# EAGLE design onetesla (EAGLE 6.1)
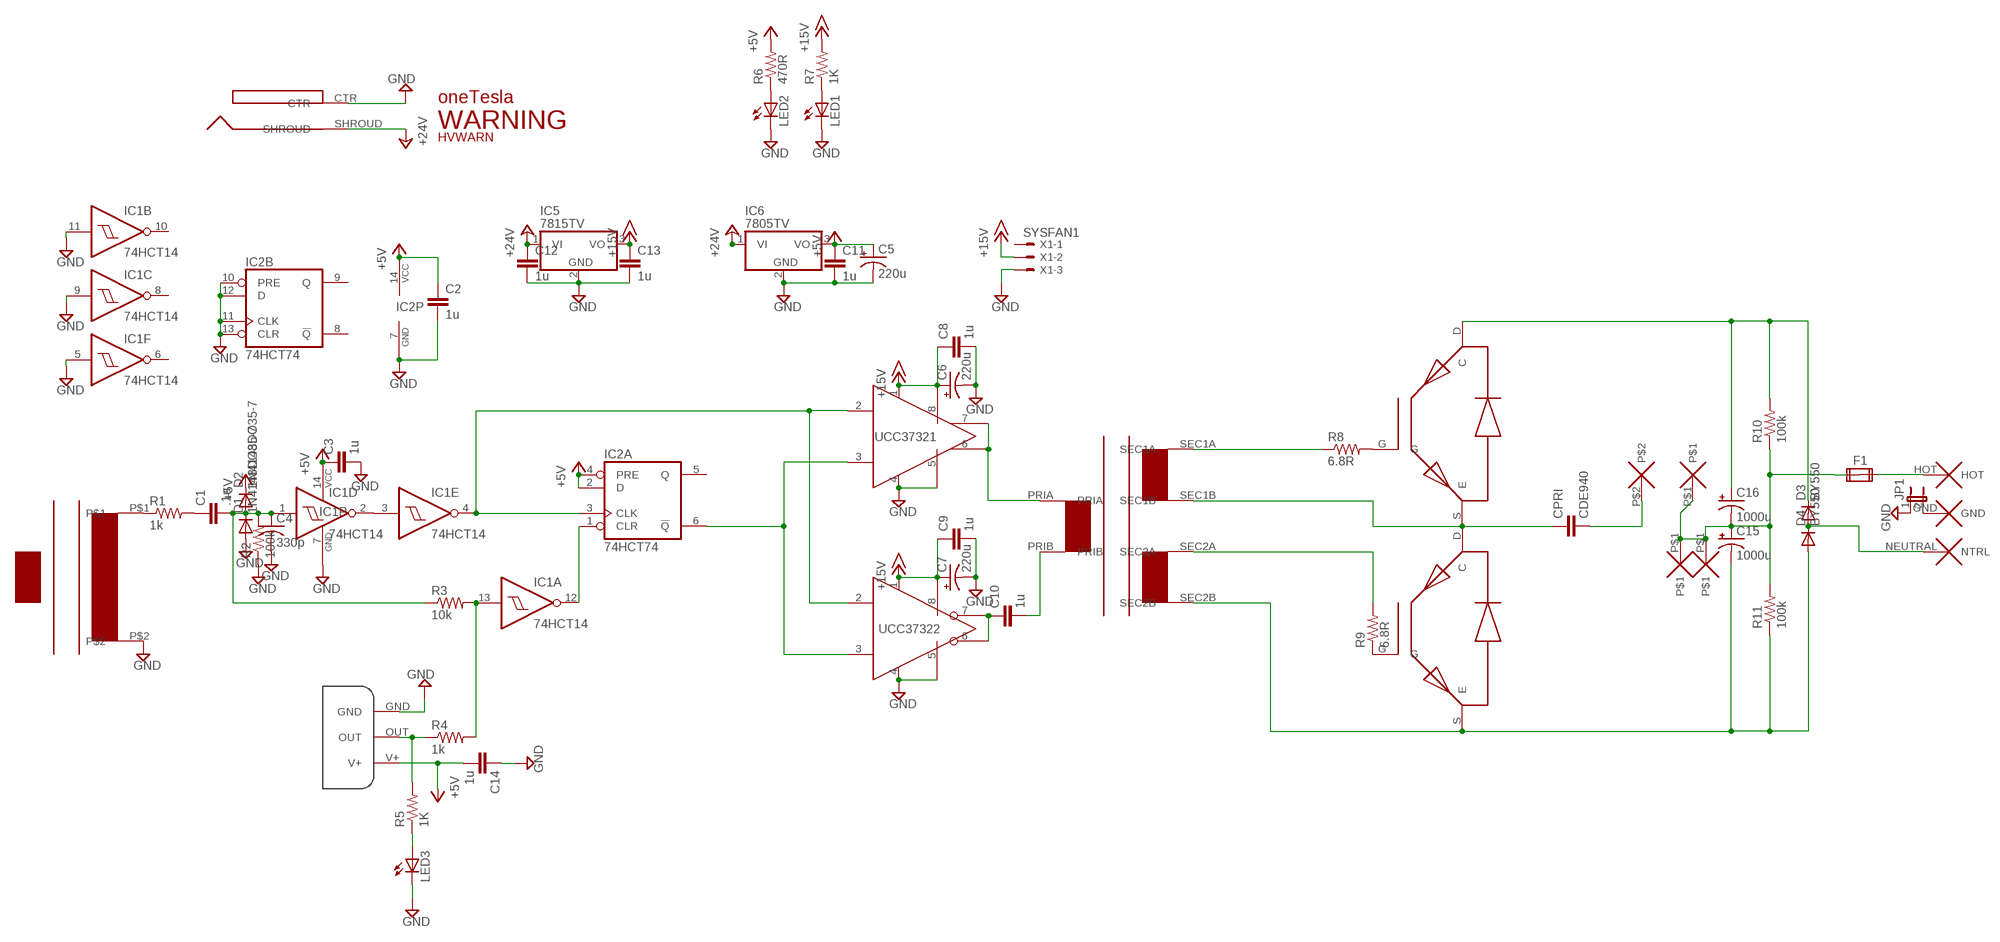
[diagram p0: schematic, sheet 1]

## Parts
C1  .1u  C-EU050-024X044  [C050-024X044]
C2  1u  C-EU050-024X044  [C050-024X044]
C3  1u  C-EU050-024X044  [C050-024X044]
C4  330p  C-US025-024X044  [C025-024X044]
C5  220u  CPOL-USE5-10.5  [E5-10,5]
C6  220u  CPOL-USE5-10.5  [E5-10,5]
C7  220u  CPOL-USE5-10.5  [E5-10,5]
C8  1u  C-EU050-024X044  [C050-024X044]
C9  1u  C-EU050-024X044  [C050-024X044]
C10  1u  C-EU050-024X044  [C050-024X044]
C11  1u  C-EU050-024X044  [C050-024X044]
C12  1u  C-EU050-024X044  [C050-024X044]
C13  1u  C-EU050-024X044  [C050-024X044]
C14  1u  C-EU050-024X044  [C050-024X044]
C15  1000u  CPOL-USE10-25  [EB25D]
C16  1000u  CPOL-USE10-25  [EB25D]
CPRI  CDE940  [CDE940]
CT1  TRIAD_CT  [CT2]
D1  1N4148DO35-7  [DO35-7]
D2  1N4148DO35-7  [DO35-7]
D3  BY550  [DO27-15]
D4  BY550  [DO27-15]
F1  FUSE2P  [FUSE1]
FB1  IFD95_OPTO  [IFD95]
IC1  74HCT14  74LS14N  [DIL14]
IC2  74HCT74  74LS74N  [DIL14]
IC3  UCC37321DIL8  [DIL08]
IC4  UCC37322DIL8  [DIL08]
IC5  7815TV  [TO220V]
IC6  7805TV  [TO220V]
J1  DC-IN  PJ-037B  [DJC0202]
J2  IEC  [IECPORT]
JP1  JP1E  [JP1]
LED1  LED5MM  [LED5MM]
LED2  LED5MM  [LED5MM]
LED3  LED5MM  [LED5MM]
LPRI  2TERMINAL  [2TERMINAL]
Q1  FGA60N65SMD  FGH40N60SMD  [TO247BV]
Q2  FGA60N65SMD  FGH40N60SMD  [TO247BV]
R1  1k  RES_5W  [0922/22]
R2  100k  R-US_0204/7  [0204/7]
R3  10k  R-US_0204/7  [0204/7]
R4  1k  R-US_0204/7  [0204/7]
R5  1K  R-US_0207/7  [0207/7]
R6  470R  R-US_0207/7  [0207/7]
R7  1K  R-US_0207/7  [0207/7]
R8  6.8R  R-US_0309/V  [0309V]
R9  6.8R  R-US_0309/V  [0309V]
R10  100k  R-US_0309/10  [0309/10]
R11  100k  R-US_0309/10  [0309/10]
U$1  LOGO  [LOGO]
U$2  GDT  [GDT]
U$3  WARNING  [WARNING]
U$4  HVWARNING  [HVWARNING]
U$9  12AWG_PAD  [12AWG_PAD]
U$11  12AWG_PAD  [12AWG_PAD]
X1  SYSFAN1  22-23-2031  [22-23-2031]

## Nets
+5V: C2.1 C3.1 C5.+ C11.1 C14.2 D2.C FB1.V+ IC1.14(P:VCC) IC2.2(A:D) IC2.4(A:PRE) IC2.14(P:VCC) IC6.3(VO) R6.2
+15V: C6.+ C7.+ C8.1 C9.1 C13.1 IC3.1(1_VDD) IC3.8(8_VDD) IC4.1(1_VDD) IC4.8(8_VDD) IC5.3(VO) R7.2 X1.2
+24V: C12.1 IC5.1(VI) IC6.1(VI) J1.SHROUD
GND: C2.2 C3.2 C4.2 C5.- C6.- C7.- C8.2 C9.2 C11.2 C12.2 C13.2 C14.1 CT1.P$2 D1.A FB1.GND IC1.5(F:I) IC1.7(P:GND) IC1.9(C:I) IC1.11(B:I) IC2.7(P:GND) IC2.10(B:PRE) IC2.11(B:CLK) IC2.12(B:D) IC2.13(B:CLR) IC3.4(4_AGND) IC3.5(5_PGND) IC4.4(4_AGND) IC4.5(5_PGND) IC5.2(GND) IC6.2(GND) J1.CTR JP1.1 LED1.K(C) LED2.K(C) LED3.K(C) R2.1 X1.3
N$1: CT1.P$1 R1.1
N$2: C1.1 R1.2
N$3: C1.2 C4.1 D1.C D2.A IC1.1(D:I) R2.2 R3.1
N$4: IC1.2(D:O) IC1.3(E:I)
N$5: IC2.6(A:!Q) IC3.3(3_ENBL) IC4.3(3_ENBL)
N$6: IC1.4(E:O) IC2.3(A:CLK) IC3.2(2_IN) IC4.2(2_IN)
N$7: LED2.A R6.1
N$8: C10.2 U$2.PRIB
N$9: CPRI.P$1 Q1.S(E) Q2.D(C) U$2.SEC1B
N$10: C10.1 IC4.6(6_OUT) IC4.7(7_OUT)
N$11: IC3.6(6_OUT) IC3.7(7_OUT) U$2.PRIA
N$12: Q1.G R8.2
N$13: LED1.A R7.1
N$14: Q2.G R9.1
N$15: FB1.OUT R4.1 R5.2
N$16: IC1.13(A:I) R3.2 R4.2
N$17: D3.A D4.C J2.NEUTRAL(NTRL)
N$18: R8.1 U$2.SEC1A
N$19: R9.2 U$2.SEC2A
N$20: IC1.12(A:O) IC2.1(A:CLR)
N$21: J2.GND JP1.2
N$22: CPRI.P$2 LPRI.P$2
N$23: F1.2A J2.HOT
N$24: LED3.A R5.1
N$25: C15.+ C16.- F1.1A F1.1B LPRI.P$1 R10.1 R11.2 U$9.P$1 U$11.P$1
V+: C16.+ D3.C Q1.D(C) R10.2
V-: C15.- D4.A Q2.S(E) R11.1 U$2.SEC2B
Unconnected: F1.2B IC1.6(F:O) IC1.8(C:O) IC1.10(B:O) IC2.5(A:Q) IC2.8(B:!Q) IC2.9(B:Q) X1.1

## Library data of the parts
C1-C3 C8-C14 = rcl:C-EU: CAPACITOR, European symbol
C4 = rcl:C-US: CAPACITOR, American symbol
C5-C7 C15 C16 = rcl:CPOL-US: POLARIZED CAPACITOR, American symbol
CPRI = smallcoil:CDE940
CT1 = smallcoil:TRIAD_CT
D1 D2 = diode:1N4148: DIODE high speed (Philips)
D3 D4 = diode:BY550: DIODE Si200 V, 5 A
F1 = special:FUSE2P: FUSE 5 x 20 mm
FB1 = tc's LIB:IFD95_OPTO
IC1 = 74xx-us:74*14: Hex schmitt trigger INVERTER
IC2 = 74xx-us:74*74: Dual D type positive edge triggered FLIP FLOP, preset and clear
IC3 = ucc37321:UCC37321: NonInverting 9A Mosfet Gate Diver with Enable
IC4 = ucc37322:UCC37322: Inverting 9A Mosfet Gate Diver with Enable
IC5 IC6 = linear:78*: Positive VOLTAGE REGULATOR Source: http://cache.national.com/ds/LM/LM78L05.pdf http://www.fairchildsemi.com/ds/LM/LM7805.pdf
J1 = onecoil:PJ-037B
J2 = onecoil:IEC
JP1 = jumper:JP1E: JUMPER
LED1-LED3 = led:LED: LED OSRAM: - CHIPLED LG R971, LG N971, LY N971, LG Q971, LY Q971, LO R971, LY R971 LH N974, LH R974 LS Q976, LO Q976, LY Q976 LO Q996 - Hyper CHIPLED LW Q18S LB Q993, LB Q99A, LB R99A - SideLED LS A670, LO A670, LY A670, LG A670, LP A670 LB A673, LV A673, LT A673, LW A673 LH A674 LY A675 LS A676, LA A676, LO A676, LY A676, LW A676 LS A679, LY A679, LG A679 - Hyper Micro SIDELED® LS Y876, LA Y876, LO Y876, LY Y876 LT Y87S - SmartLED LW L88C, LW L88S LB L89C, LB L89S, LG L890 LS L89K, LO L89K, LY L89K LS L896, LA L896, LO L896, LY L896 - TOPLED LS T670, LO T670, LY T670, LG T670, LP T670 LSG T670, LSP T670, LSY T670, LOP T670, LYG T670 LG T671, LOG T671, LSG T671 LB T673, LV T673, LT T673, LW T673 LH T674 LS T676, LA T676, LO T676, LY T676, LB T676, LH T676, LSB T676, LW T676 LB T67C, LV T67C, LT T67C, LS T67K, LO T67K, LY T67K, LW E67C LS E67B, LA E67B, LO E67B, LY E67B, LB E67C, LV E67C, LT E67C LW T67C LS T679, LY T679, LG T679 LS T770, LO T770, LY T770, LG T770, LP T770 LB T773, LV T773, LT T773, LW T773 LH T774 LS E675, LA E675, LY E675, LS T675 LS T776, LA T776, LO T776, LY T776, LB T776 LHGB T686 LT T68C, LB T68C - Hyper Mini TOPLED® LB M676 - Mini TOPLED Santana® LG M470 LS M47K, LO M47K, LY M47K Source: http://www.osram.convergy.de LUXEON: - LUMILED® LXK2-PW12-R00, LXK2-PW12-S00, LXK2-PW14-U00, LXK2-PW14-V00 LXK2-PM12-R00, LXK2-PM12-S00, LXK2-PM14-U00 LXK2-PE12-Q00, LXK2-PE12-R00, LXK2-PE12-S00, LXK2-PE14-T00, LXK2-PE14-U00 LXK2-PB12-K00, LXK2-PB12-L00, LXK2-PB12-M00, LXK2-PB14-N00, LXK2-PB14-P00, LXK2-PB14-Q00 LXK2-PR12-L00, LXK2-PR12-M00, LXK2-PR14-Q00, LXK2-PR14-R00 LXK2-PD12-Q00, LXK2-PD12-R00, LXK2-PD12-S00 LXK2-PH12-R00, LXK2-PH12-S00 LXK2-PL12-P00, LXK2-PL12-Q00, LXK2-PL12-R00 Source: www.luxeon.com KINGBRIGHT: KA-3528ASYC Source: www.kingbright.com
LPRI = onecoil:2TERMINAL
Q1 Q2 = onecoil:FGH40N60SMD
R1 = onecoil:RES_5W
R2-R4 R10 R11 = resistor:R-US_: RESISTOR, American symbol
R5-R9 = rcl:R-US_: RESISTOR, American symbol
U$1 = onecoil:LOGO
U$2 = onecoil:GDT: Half-Bridge GDT
U$3 = onecoil:WARNING
U$4 = onecoil:HVWARNING
U$9 U$11 = onecoil:12AWG_PAD
X1 = con-molex:22-23-2031: .100" (2.54mm) Center Header - 3 Pin; MF: MOLEX; MPN: 22-23-2031; OC_FARNELL: 1462950; OC_NEWARK: 30C0862

## Board
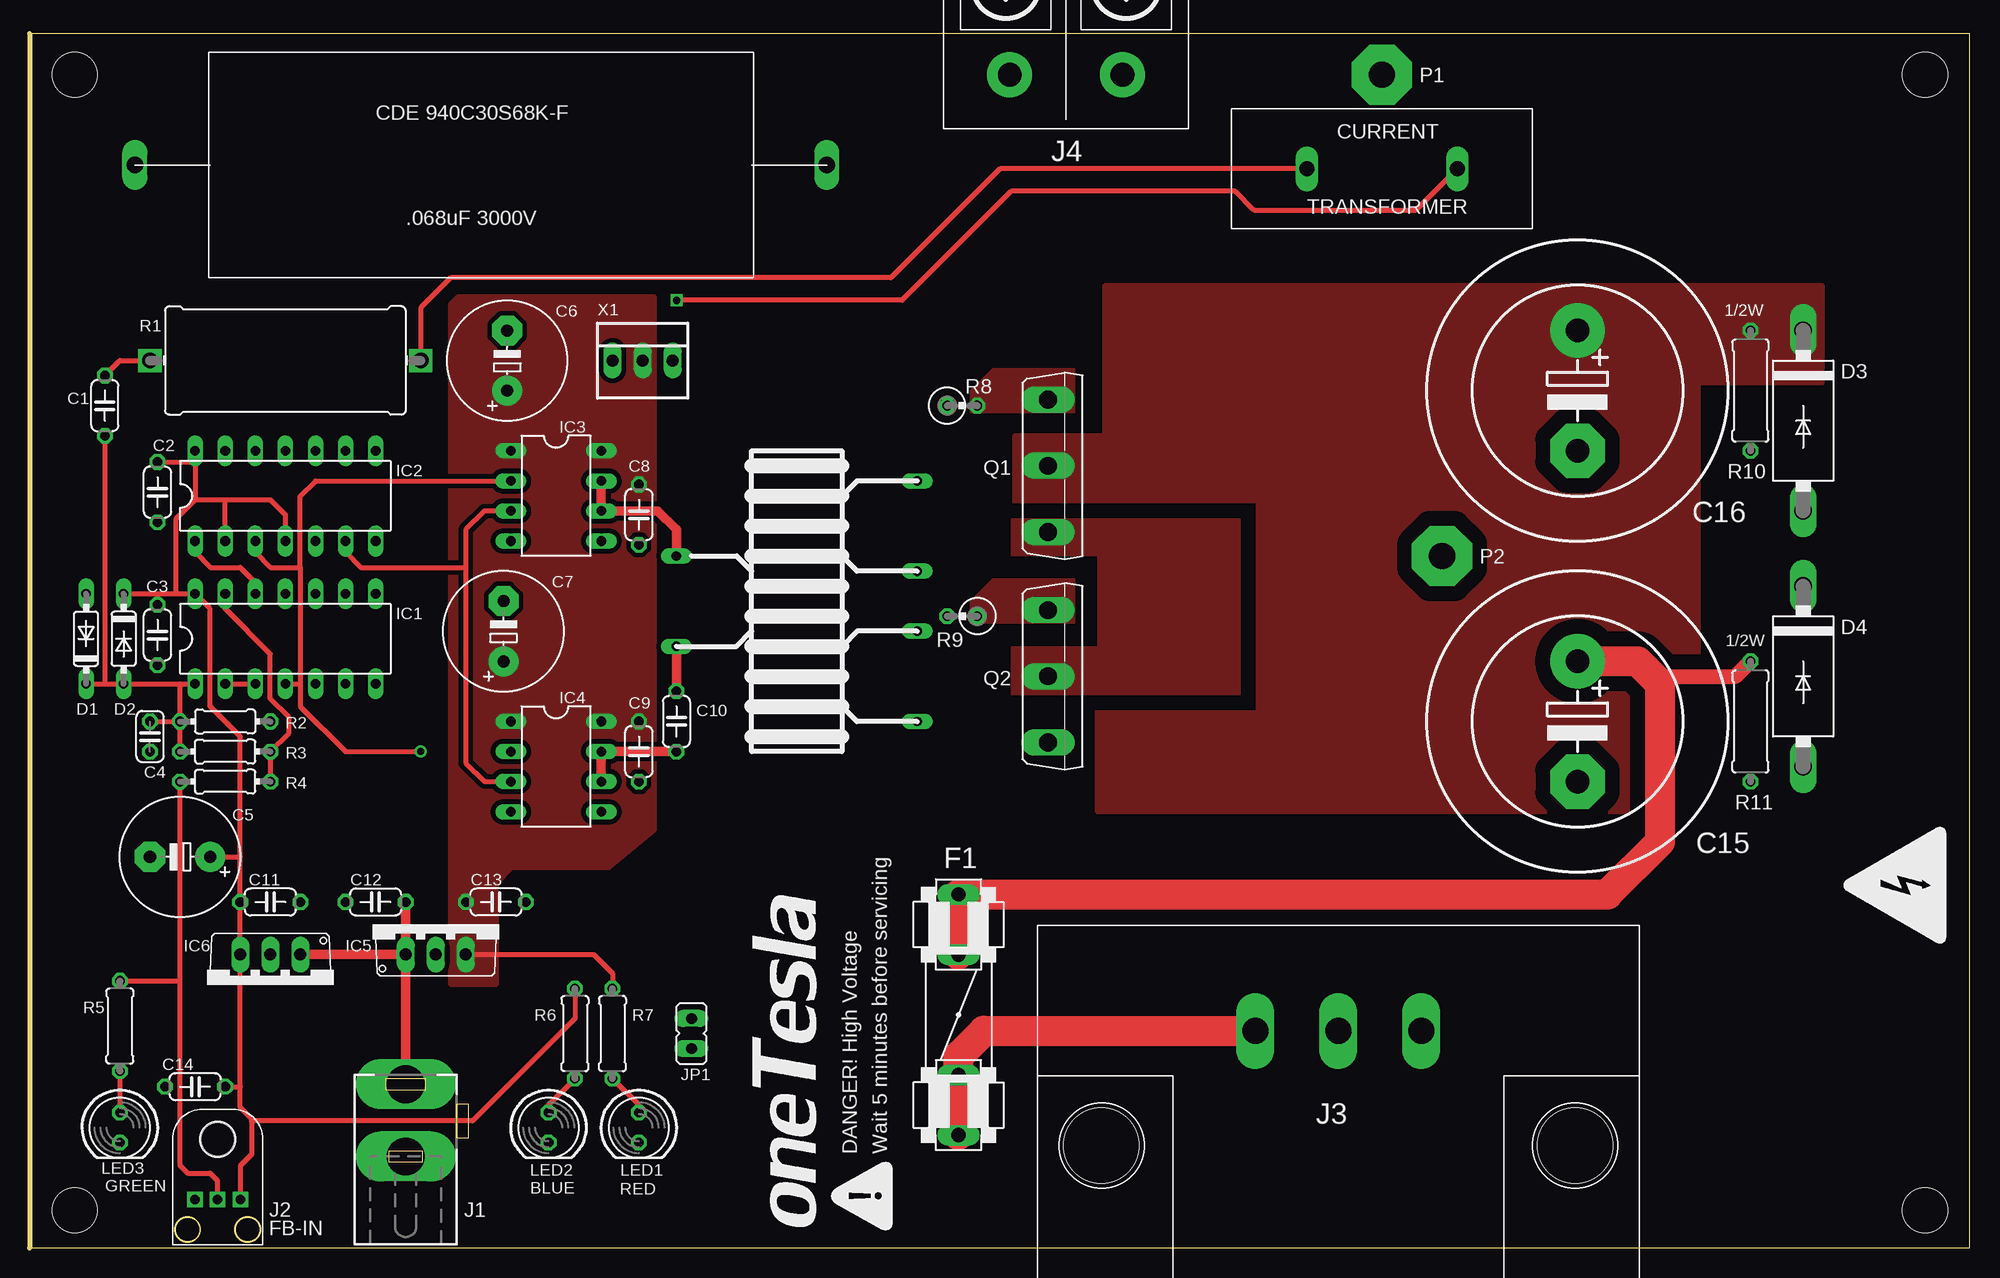
[diagram p1: board, top side]
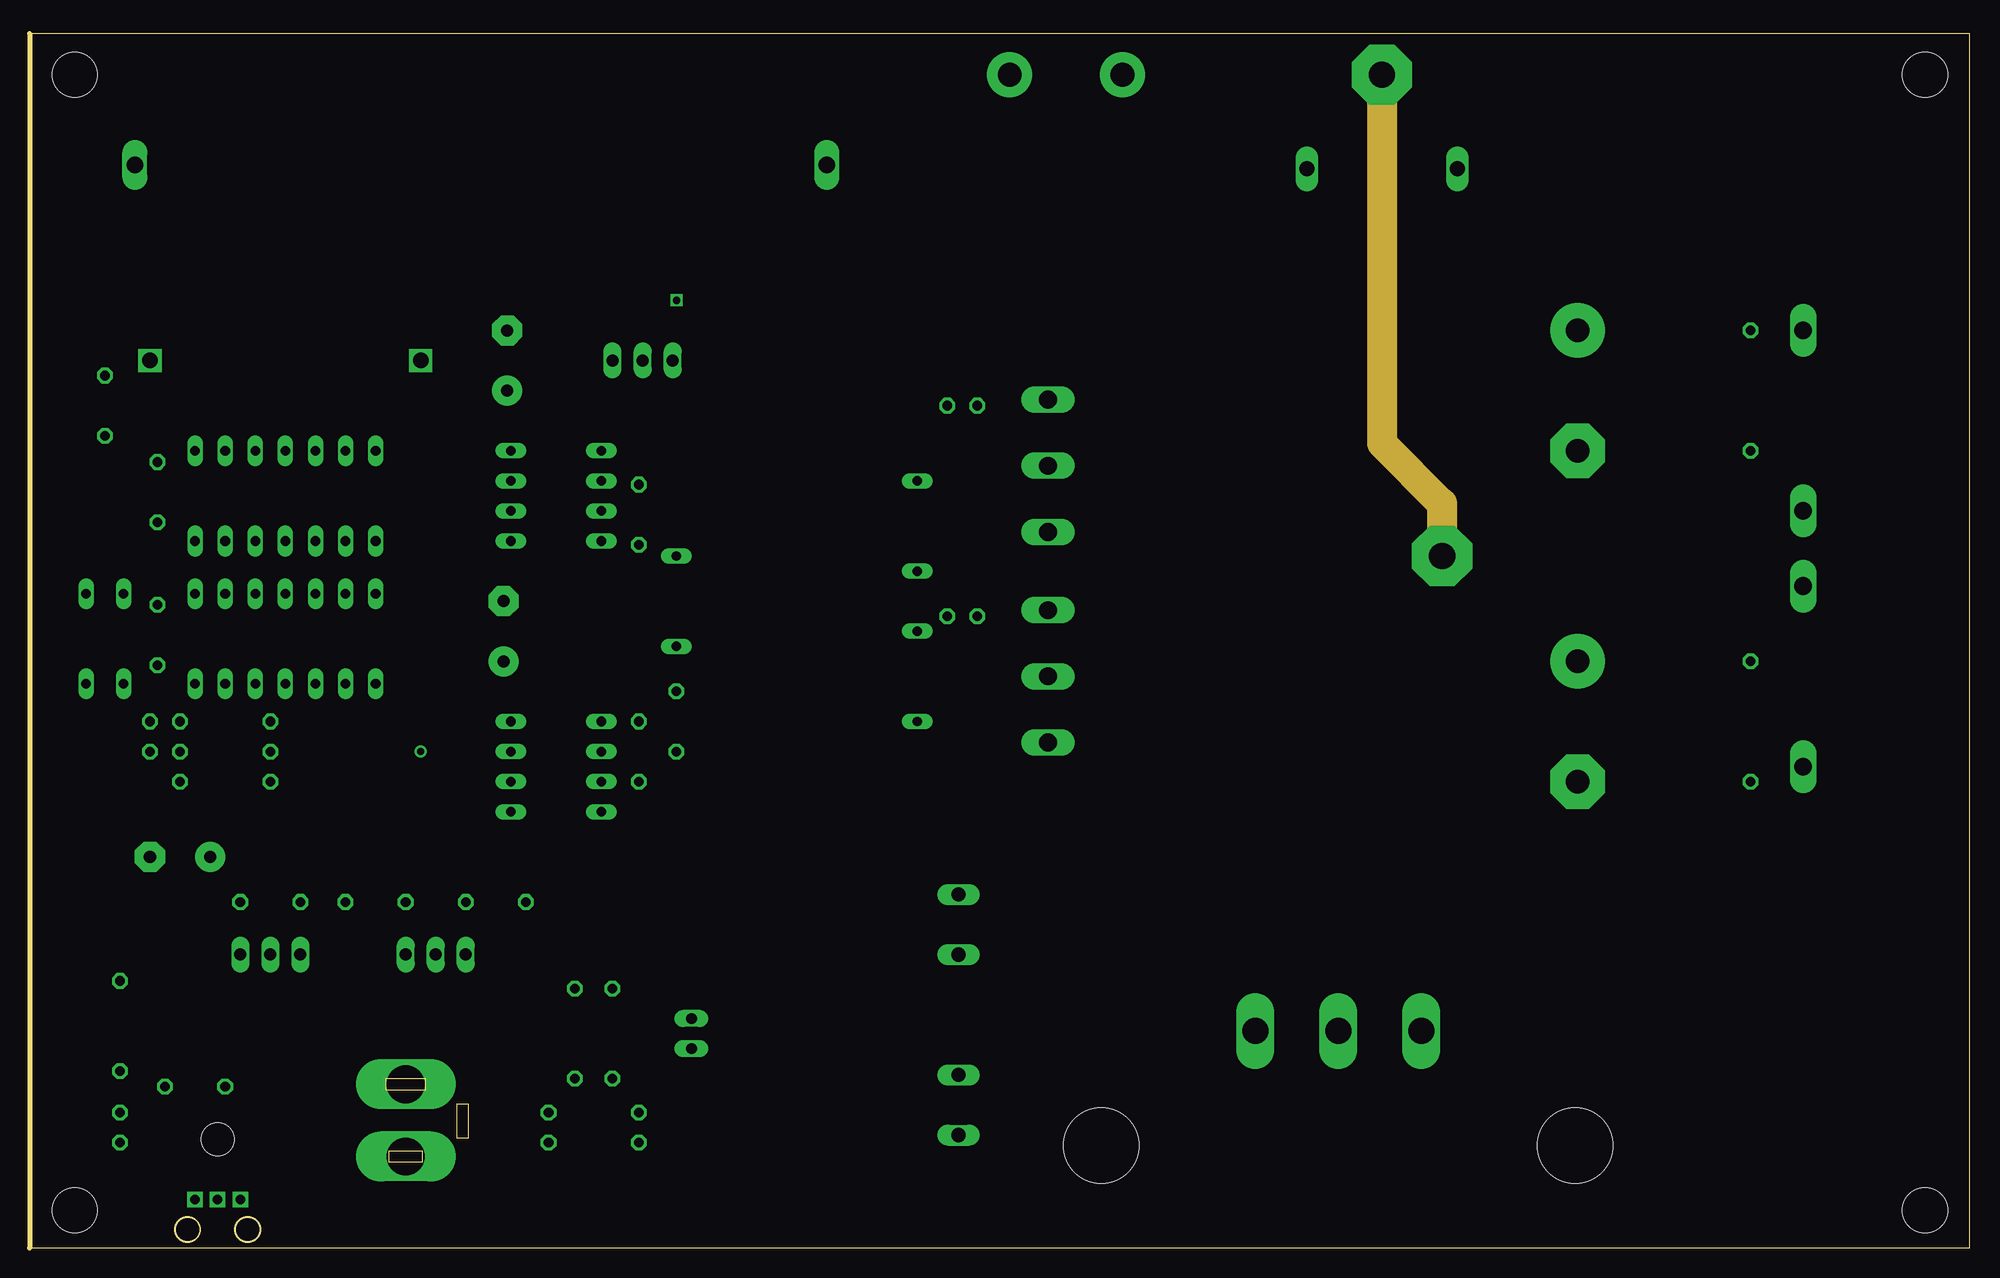
[diagram p2: board, inner layer Route2]
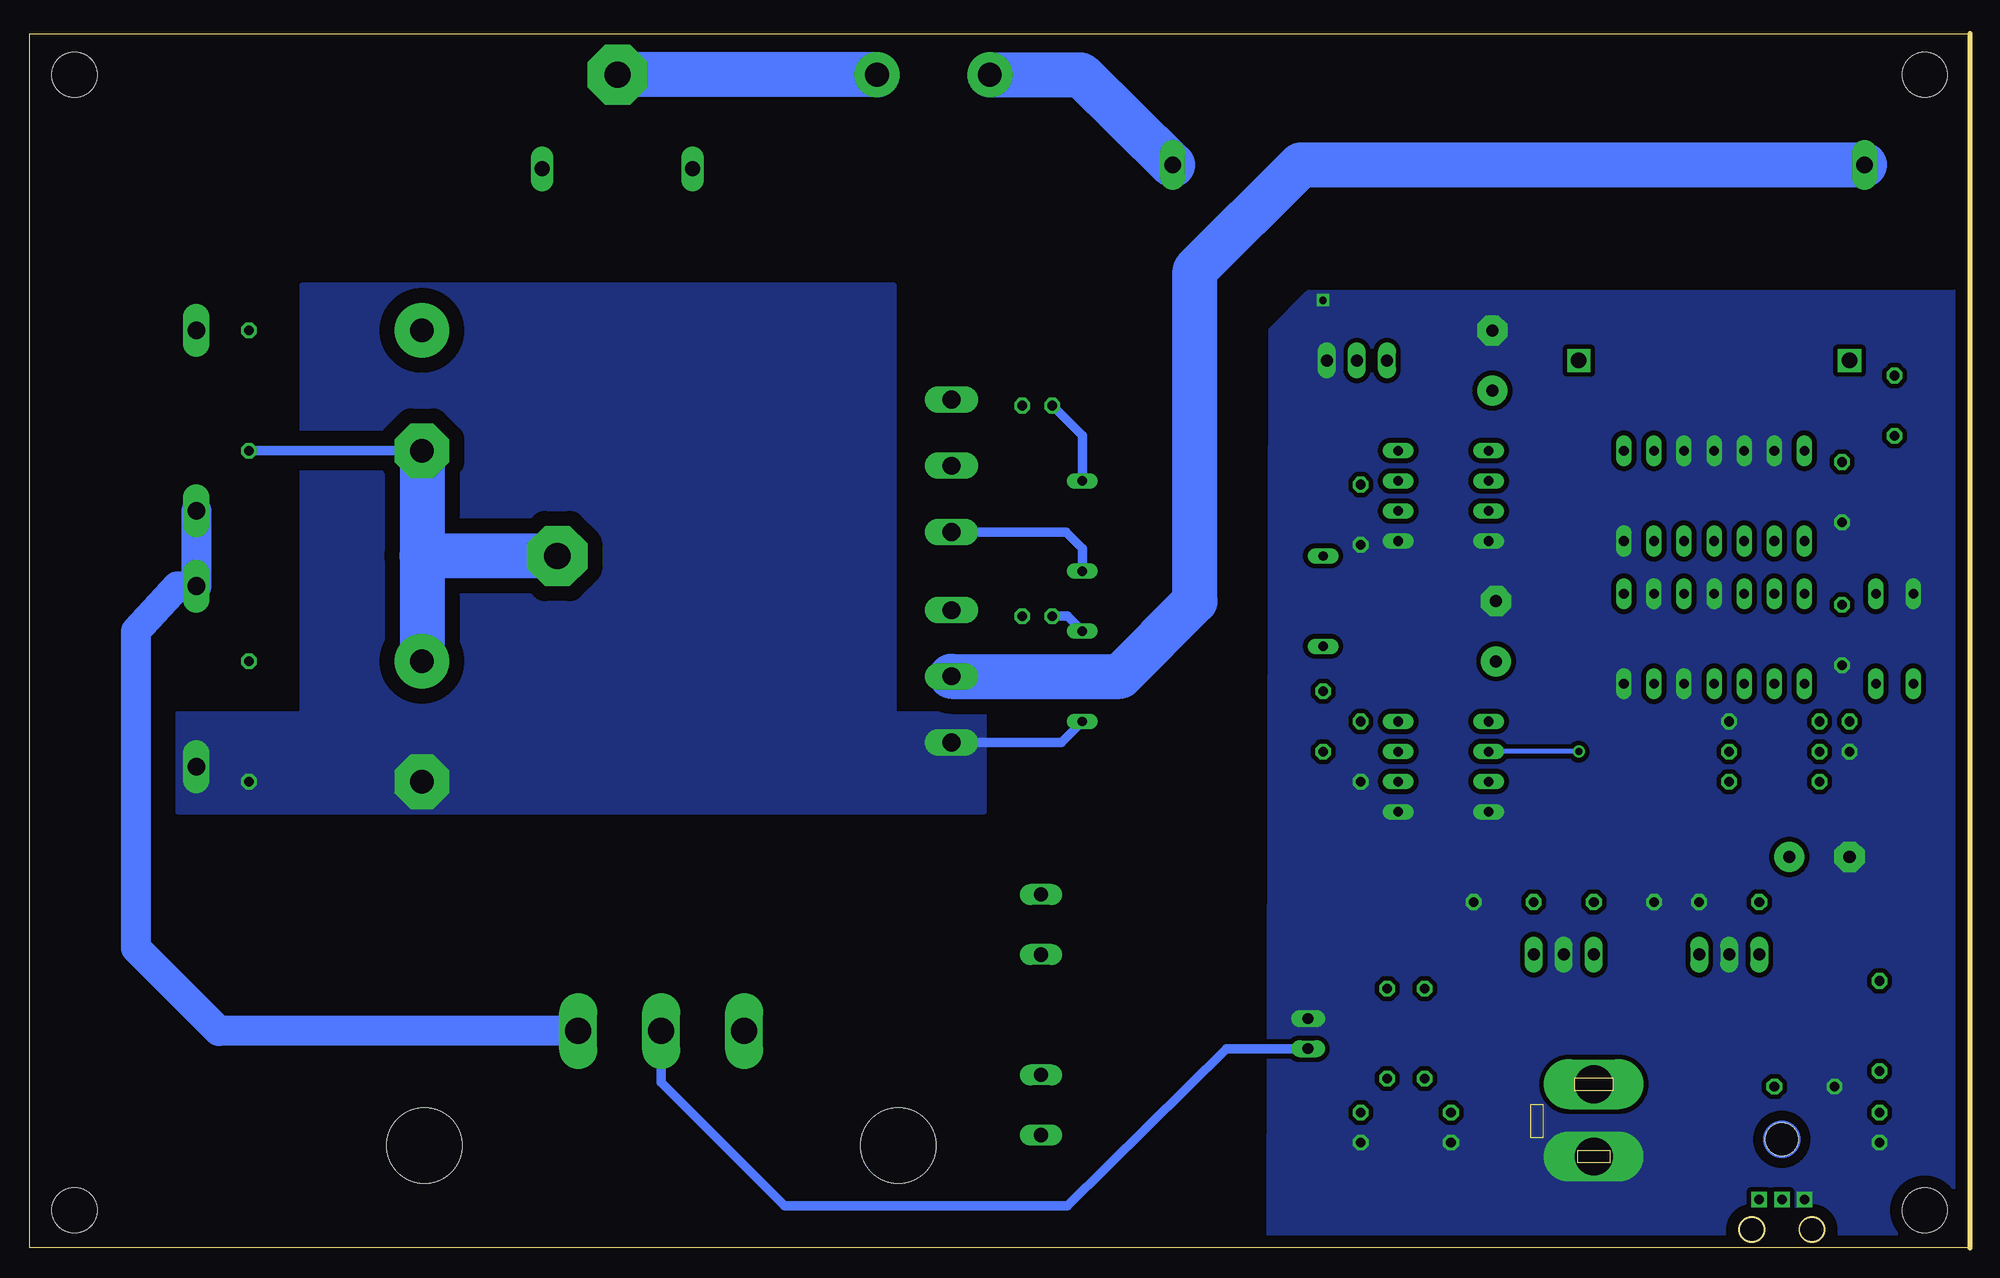
[diagram p3: board, bottom side, seen from below]

Size 163.81 x 102.54 mm. Coordinates in mm from the lower left corner, seen from the top.
Outline: 0,0 163.81,0 163.81,102.54 0,102.54 0,0
Copper layers (1*2*16): Top 0.035mm / dielectric 1.5mm / Route2 0.035mm / dielectric 0.15mm / Bottom 0.035mm
Design rules: minimum track width 10mil, minimum drill 24mil, track to track 8mil, track to pad 8mil, pad to pad 8mil, via to via 8mil, smd to smd 8mil, copper to edge 40mil, drill to drill 8mil, minimum pad ring 10mil, minimum via ring 8mil, stop-mask expansion 4mil, vias tented up to drill 0mil, thermal gap 10mil
Holes 2.8 mm at 15.88,9.17
Holes 2 mm at 13.34,1.55 18.41,1.55
Holes 3.81 mm at 3.81,99.06 160.02,99.06 160.02,3.18 3.81,3.18
Holes 6.35 mm at 90.49,8.64 130.49,8.64

### Footprints (pad centres in the part's own frame; a part is rotated, then mirrored left to right if it is on the bottom)
C050-024X044 = drill 0.813 octagon: 1 -2.54,0; 2 2.54,0
C025-024X044 = drill 0.813 octagon: 1 -1.27,0; 2 1.27,0
E5-10,5 = drill 1.016 pad 2.54: + -2.54,0 | drill 1.016 pad 2.54 octagon: - 2.54,0
EB25D = drill 2.007 pad 4.597: + -5.08,0 | drill 2.007 pad 4.597 octagon: - 5.08,0
CDE940 = drill 1.4 long: P$1 -29.21,0; P$2 29.21,0
CT2 = drill 1.27 long: P$1 -6.35,0; P$2 6.35,0
DO35-7 = drill 0.813 long: A 3.81,0; C -3.81,0
DO27-15 = drill 1.499 long: A 7.62,0; C -7.62,0
FUSE1 = drill 1.194 long: 1A -10.16,0; 1B -5.08,0; 2A 10.16,0; 2B 5.08,0
IFD95 = drill 0.8 square: GND 1.905,5.08; OUT 0,5.08; V+ -1.905,5.08
DIL14 = drill 0.813 long: 1 -7.62,-3.81; 2 -5.08,-3.81; 3 -2.54,-3.81; 4 0,-3.81; 5 2.54,-3.81; 6 5.08,-3.81; 7 7.62,-3.81; 8 7.62,3.81; 9 5.08,3.81; 10 2.54,3.81; 11 0,3.81; 12 -2.54,3.81; 13 -5.08,3.81; 14 -7.62,3.81
DIL08 = drill 0.813 long: 1 -3.81,-3.81; 2 -1.27,-3.81; 3 1.27,-3.81; 4 3.81,-3.81; 5 3.81,3.81; 6 1.27,3.81; 7 -1.27,3.81; 8 -3.81,3.81
TO220V = drill 1.016 long: 1 -2.54,-2.54; 2 0,-2.54; 3 2.54,-2.54
DJC0202 = drill 3.2 pad 3.81 long: CTR 0,-3; SHROUD 0,3.1
IECPORT = drill 2.2 long: GND 0,0; HOT -7,0; NEUTRAL 7,0
JP1 = drill 0.914 long: 1 0,-1.27; 2 0,1.27
LED5MM = drill 0.813 octagon: A -1.27,0; K 1.27,0
2TERMINAL = drill 2 pad 3.81: P$1 -4.763,0; P$2 4.763,0
TO247BV = drill 1.499 long: D 0,-0.381; G -5.588,-0.381; S 5.588,-0.381
0922/22 = drill 1.3 square: 1 -11.43,0; 2 11.43,0
0204/7 = drill 0.813 octagon: 1 -3.81,0; 2 3.81,0
0207/7 = drill 0.813 octagon: 1 -3.81,0; 2 3.81,0
0309V = drill 0.813 octagon: 1 -1.27,0; 2 1.27,0
0309/10 = drill 0.813 octagon: 1 -5.08,0; 2 5.08,0
GDT = drill 0.8 long: PRIA -10.16,3.81; PRIB -10.16,-3.81; SEC1A 10.16,10.16; SEC1B 10.16,2.54; SEC2A 10.16,-2.54; SEC2B 10.16,-10.16
12AWG_PAD = drill 2.2 pad 5.08 octagon: P$1 0,0
22-23-2031 = drill 1 long: 1 -2.54,0; 2 0,0; 3 2.54,0

### Placement (x,y rotation side)
C1  6.35,71.12 270 top
C2  10.79,63.82 270 top
C3  10.79,51.75 270 top
C4  10.16,43.18 270 top
C5  12.7,33.02 180 top
C6  40.32,74.93 90 top
C7  40.01,52.07 90 top
C8  51.44,61.91 270 top
C9  51.44,41.91 270 top
C10  54.61,44.45 90 top
C11  20.32,29.21 0 top
C12  29.21,29.21 180 top
C13  39.37,29.21 0 top
C14  13.97,13.62 0 top
C15  130.68,44.45 270 top
C16  130.68,72.39 270 top
CPRI  38.1,91.44 0 top
CT1  114.17,91.12 0 top
D1  4.76,51.44 90 top
D2  7.94,51.44 270 top
D3  149.73,69.85 270 top
D4  149.73,48.26 270 top
F1  78.42,19.68 270 top
FB1  15.88,9.17 180 top
IC1  21.59,51.44 0 top
IC2  21.59,63.5 0 top
IC3  44.45,63.5 270 top
IC4  44.45,40.64 270 top
IC5  34.29,27.3 0 top
IC6  20.32,22.22 180 top
J1  31.75,10.72 0 top
J2  110.49,18.32 0 top
JP1  55.88,18.1 180 top
LED1  51.44,10.16 270 top
LED2  43.82,10.16 270 top
LED3  7.62,10.16 270 top
LPRI  87.5,99.06 180 top
Q1  86.36,66.04 270 top
Q2  86.36,48.26 270 top
R1  21.59,74.93 180 top
R2  16.51,44.45 180 top
R3  16.51,41.91 0 top
R4  16.51,39.37 0 top
R5  7.62,18.73 90 top
R6  46.04,18.1 90 top
R7  49.21,18.1 90 top
R8  78.74,71.12 0 top
R9  78.74,53.34 180 top
R10  145.29,72.39 90 top
R11  145.29,44.45 90 top
U$1  67.44,1.03 90 top
U$2  64.77,54.61 0 top
U$3  75.56,-2.22 90 top
U$4  164.47,25.72 90 top
U$9  119.25,58.42 0 top
U$11  114.17,99.06 0 top
X1  51.75,74.93 0 top

### Tracks (layer width: path | path; a pad name or v marks a point on that pad's centre or on a via)
+5V
  Top 0.406: 17.78,33.02 C11.1 IC6.3 17.78,13.62 | 17.78,33.02 17.78,43.18 15.24,45.72 15.24,53.98 IC1.14 12.38,55.24 | D2.C 10.79,55.24 | 10.79,55.24 12.38,55.24 | C3.1 10.79,55.24 | 12.38,55.24 12.38,61.59 13.97,63.18 | 13.97,63.18 16.51,63.18 | 16.51,63.18 20.32,63.18 21.59,61.91 IC2.4 | IC2.2 16.51,63.18 | IC2.14 13.97,66.36 | 13.97,66.36 13.97,63.18 | C2.1 13.97,66.36 | C5.+ 17.78,33.02 | R6.2 46.04,19.37 37.39,10.72 18.73,10.72 | 18.73,10.72 18.73,7.9 17.78,6.95 FB1.V+ | 18.73,10.72 18.73,10.91 17.78,11.86 17.78,13.62 | C14.2 17.78,13.62
+15V
  Top 0.406: IC5.3 47.62,24.77 49.21,23.18 R7.2
  pour Top (isolate 0.406, no thermals): 39.37,22.22 35.56,22.22 35.56,79.69 36.2,80.33 52.71,80.33 52.71,35.24 48.9,32.07 40.64,32.07 39.37,30.8
+24V
  Top 0.813: J1.SHROUD IC5.1 | IC5.1 IC6.1 | C12.1 IC5.1
GND  (via drill 0.6)
  Top 0.406: v54.61,80.01 73.66,80.01 82.87,89.22 101.79,89.22 103.38,87.63 117.03,87.63 CT1.P$2
  pour Bottom (isolate 0.406, no thermals): 0,80.64 55.88,80.64 59.05,77.47 59.21,-0.03 0.16,-0.03
N$1
  Top 0.406: CT1.P$1 81.91,91.12 72.71,81.92 35.56,81.92 33.02,79.38 R1.1
N$2
  Top 0.406: C1.1 7.62,74.93 R1.2
N$3
  Top 0.406: 12.7,47.63 D2.A 6.35,47.63 | 12.7,47.63 IC1.1 | C1.2 6.35,47.63 | D1.C 6.35,47.63 | R3.1 R2.2 | R2.2 12.7,47.63 | C4.1 R2.2
N$4
  Top 0.406: IC1.2 IC1.3
N$5
  Top 0.406: IC3.3 38.42,62.23 36.83,60.64 36.83,57.47 | 36.83,57.47 36.83,40.96 38.42,39.37 IC4.3 | 36.83,57.47 27.94,57.47 26.67,58.74 IC2.6
N$6  (via drill 0.6)
  Top 0.406: 22.86,57.47 22.86,63.5 24.13,64.77 IC3.2 | v33.02,41.91 26.67,41.91 22.86,45.72 22.86,47.63 | IC2.3 19.05,58.74 20.32,57.47 22.86,57.47 | IC1.4 22.86,47.63 | 22.86,57.47 22.86,47.63
  Bottom 0.406: v33.02,41.91 IC4.2
N$7
  Top 0.406: LED2.A 43.82,12.07 R6.1
N$8
  Top 0.813: C10.2 U$2.PRIB
N$9
  Bottom 0.813: Q1.S 76.33,60.45 74.93,59.06 U$2.SEC1B
  Bottom 3.81: CPRI.P$1 56.52,91.44 65.41,82.55 65.41,54.61 71.75,48.26 Q2.D
  pour Top (no thermals): 82.87,61.59 102.23,61.59 102.23,46.67 82.87,46.67 82.87,50.8 90.17,50.8 90.17,58.42 82.87,58.42
N$10
  Top 0.813: IC4.6 IC4.7 C10.1
N$11
  Top 0.813: IC3.7 IC3.6 53.02,62.23 54.61,60.64 U$2.PRIA
N$12
  pour Top (no thermals): 88.27,70.48 88.27,74.3 81.28,74.3 79.38,72.39 79.38,70.48
N$13
  Top 0.406: LED1.A 51.44,12.07 R7.1
N$14
  pour Top (no thermals): 79.38,52.7 88.27,52.7 88.27,56.52 81.28,56.52 79.38,54.61
N$15
  Top 0.406: 12.7,22.54 12.7,6.95 13.34,6.32 15.24,6.32 15.88,5.68 FB1.OUT | 12.7,22.54 R4.1 | R5.2 12.7,22.54
N$16
  Top 0.406: IC1.13 16.51,53.98 20.32,50.16 20.32,46.35 21.91,44.77 21.91,43.5 R3.2 R4.2
N$17
  Bottom 2.54: D3.A D4.C 151.32,55.88 154.81,52.07 154.81,25.31 147.83,18.32 J2.NEUTRAL
N$18
  Bottom 0.813: U$2.SEC1A 74.93,68.58 R8.1
N$19
  Bottom 0.813: U$2.SEC2A 76.2,53.34 R9.2
N$20
  Top 0.406: IC2.1 13.97,58.74 15.24,57.47 17.78,57.47 19.05,56.2 IC1.12
N$21
  Bottom 0.813: JP1.2 62.75,16.83 76.18,3.55 100.07,3.55 110.49,13.97 J2.GND
N$22
  Bottom 3.81: LPRI.P$2 75.06,99.06 CPRI.P$2
N$23
  Top 2.54: F1.2A 78.42,16.19 80.57,18.34 103.47,18.34 J2.HOT
N$24
  Top 0.406: R5.1 LED3.A
N$25
  Top 0.813: 137.67,48.26 137.35,47.94
  Top 1.27: 137.67,48.26 144.02,48.26 R11.2
  Top 2.54: C15.+ 135.76,49.53 137.35,47.94 137.67,47.63 137.67,34.29 133.22,29.84 F1.1A F1.1B
  Route2 2.54: U$11.P$1 114.17,67.94 119.25,62.87 U$9.P$1
  Bottom 0.813: C16.- 144.02,67.31 R10.1
  Bottom 3.81: C16.- 130.68,58.42 | 130.68,58.42 C15.+ | U$9.P$1 130.68,58.42 | LPRI.P$1 U$11.P$1
V+
  pour Top (isolate 1.27, rank 2, no thermals): 83.18,68.58 90.8,68.58 90.8,81.28 151.32,81.28 151.32,73.03 140.84,73.03 140.84,36.83 90.17,36.83 90.17,62.87 83.18,62.87
V-
  Bottom 0.813: Q2.S 76.71,42.67 U$2.SEC2B
  pour Bottom (isolate 1.27, no thermals): 83.18,45.09 90.8,45.09 90.8,81.28 140.84,81.28 140.84,45.09 151.32,45.09 151.32,36.83 83.18,36.83

### Text on the board
tNames: P1 | J4 | 1/2W | P2 | 1/2W | J3 | GREEN | BLUE | RED | J2 | FB-IN
tDocu: HIGH VOLTAGE Do not touch | DO NOT OPERATE ON 220V! | Version 2.1/110 | 110V use only | Do not operate | outside of chassis | 10A 250V fast-acting fuse only